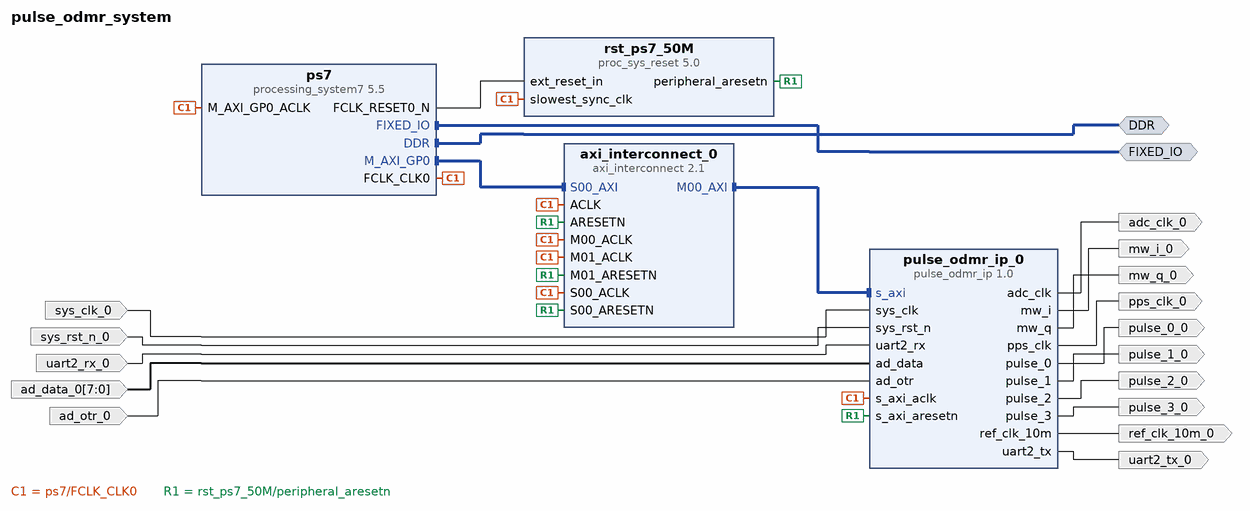
[diagram p0: block diagram of the top level]
# Vivado block design pulse_odmr_system, xc7z020clg400-2, Vivado 2020.2
create_bd_design pulse_odmr_system

create_bd_intf_port -mode Master -vlnv xilinx.com:interface:ddrx_rtl:1.0 DDR
create_bd_intf_port -mode Master -vlnv xilinx.com:display_processing_system7:fixedio_rtl:1.0 FIXED_IO
create_bd_port -dir I -type clk sys_clk_0
create_bd_port -dir I -type rst sys_rst_n_0
create_bd_port -dir I uart2_rx_0
create_bd_port -dir O uart2_tx_0
create_bd_port -dir O ref_clk_10m_0
create_bd_port -dir O -type clk pps_clk_0
create_bd_port -dir O mw_i_0
create_bd_port -dir O mw_q_0
create_bd_port -dir I -from 7 -to 0 ad_data_0
create_bd_port -dir I ad_otr_0
create_bd_port -dir O pulse_0_0
create_bd_port -dir O pulse_1_0
create_bd_port -dir O pulse_2_0
create_bd_port -dir O pulse_3_0
create_bd_port -dir O -type clk adc_clk_0

create_bd_cell -type ip -vlnv xilinx.com:ip:processing_system7:5.5 ps7
set_property -dict [list \
  CONFIG.PCW_FPGA0_PERIPHERAL_FREQMHZ 50 \
  CONFIG.PCW_GPIO_MIO_GPIO_ENABLE 1 \
  CONFIG.PCW_GPIO_MIO_GPIO_IO MIO \
  CONFIG.PCW_I2C_RESET_ENABLE 1 \
  CONFIG.PCW_IRQ_F2P_INTR 1 \
  CONFIG.PCW_UART1_PERIPHERAL_ENABLE 1 \
  CONFIG.PCW_UART1_UART1_IO {MIO 48 .. 49} \
  CONFIG.PCW_UART_PERIPHERAL_FREQMHZ 100 \
  CONFIG.PCW_USB_RESET_ENABLE 1 \
  CONFIG.PCW_USE_FABRIC_INTERRUPT 1 \
] [get_bd_cells ps7]
# 194 more settings of ps7 are not shown: defaults, MIO pin electricals, DDR timing, and values the tool derives
create_bd_cell -type ip -vlnv odmr.lab:user:pulse_odmr_ip:1.0 pulse_odmr_ip_0
create_bd_cell -type ip -vlnv xilinx.com:ip:axi_interconnect:2.1 axi_interconnect_0
set_property -dict {CONFIG.NUM_MI 2} [get_bd_cells axi_interconnect_0]
create_bd_cell -type ip -vlnv xilinx.com:ip:proc_sys_reset:5.0 rst_ps7_50M

# ---- connections ----

connect_bd_intf_net [get_bd_intf_pins ps7/M_AXI_GP0] [get_bd_intf_pins axi_interconnect_0/S00_AXI]
connect_bd_intf_net [get_bd_intf_pins axi_interconnect_0/M00_AXI] [get_bd_intf_pins pulse_odmr_ip_0/s_axi]
connect_bd_intf_net [get_bd_intf_ports FIXED_IO] [get_bd_intf_pins ps7/FIXED_IO]
connect_bd_intf_net [get_bd_intf_ports DDR] [get_bd_intf_pins ps7/DDR]
connect_bd_net [get_bd_pins ps7/FCLK_CLK0] \
  [get_bd_pins ps7/M_AXI_GP0_ACLK] [get_bd_pins axi_interconnect_0/S00_ACLK] [get_bd_pins rst_ps7_50M/slowest_sync_clk] \
  [get_bd_pins pulse_odmr_ip_0/s_axi_aclk] [get_bd_pins axi_interconnect_0/M01_ACLK] [get_bd_pins axi_interconnect_0/ACLK] \
  [get_bd_pins axi_interconnect_0/M00_ACLK]
connect_bd_net [get_bd_pins ps7/FCLK_RESET0_N] [get_bd_pins rst_ps7_50M/ext_reset_in]
connect_bd_net [get_bd_pins rst_ps7_50M/peripheral_aresetn] \
  [get_bd_pins axi_interconnect_0/S00_ARESETN] [get_bd_pins pulse_odmr_ip_0/s_axi_aresetn] \
  [get_bd_pins axi_interconnect_0/M01_ARESETN] [get_bd_pins axi_interconnect_0/ARESETN]
connect_bd_net -net sys_clk_0_1 [get_bd_ports sys_clk_0] [get_bd_pins pulse_odmr_ip_0/sys_clk]
connect_bd_net -net sys_rst_n_0_1 [get_bd_ports sys_rst_n_0] [get_bd_pins pulse_odmr_ip_0/sys_rst_n]
connect_bd_net -net uart2_rx_0_1 [get_bd_ports uart2_rx_0] [get_bd_pins pulse_odmr_ip_0/uart2_rx]
connect_bd_net [get_bd_pins pulse_odmr_ip_0/uart2_tx] [get_bd_ports uart2_tx_0]
connect_bd_net [get_bd_pins pulse_odmr_ip_0/ref_clk_10m] [get_bd_ports ref_clk_10m_0]
connect_bd_net [get_bd_pins pulse_odmr_ip_0/pps_clk] [get_bd_ports pps_clk_0]
connect_bd_net [get_bd_pins pulse_odmr_ip_0/mw_i] [get_bd_ports mw_i_0]
connect_bd_net [get_bd_pins pulse_odmr_ip_0/mw_q] [get_bd_ports mw_q_0]
connect_bd_net -net ad_data_0_1 [get_bd_ports ad_data_0] [get_bd_pins pulse_odmr_ip_0/ad_data]
connect_bd_net -net ad_otr_0_1 [get_bd_ports ad_otr_0] [get_bd_pins pulse_odmr_ip_0/ad_otr]
connect_bd_net [get_bd_pins pulse_odmr_ip_0/pulse_0] [get_bd_ports pulse_0_0]
connect_bd_net [get_bd_pins pulse_odmr_ip_0/pulse_1] [get_bd_ports pulse_1_0]
connect_bd_net [get_bd_pins pulse_odmr_ip_0/pulse_2] [get_bd_ports pulse_2_0]
connect_bd_net [get_bd_pins pulse_odmr_ip_0/pulse_3] [get_bd_ports pulse_3_0]
connect_bd_net [get_bd_pins pulse_odmr_ip_0/adc_clk] [get_bd_ports adc_clk_0]

# ---- address map ----
assign_bd_address -offset 0x43C00000 -range 64K -target_address_space [get_bd_addr_spaces ps7/Data] [get_bd_addr_segs pulse_odmr_ip_0/s_axi/reg0]

validate_bd_design
save_bd_design
